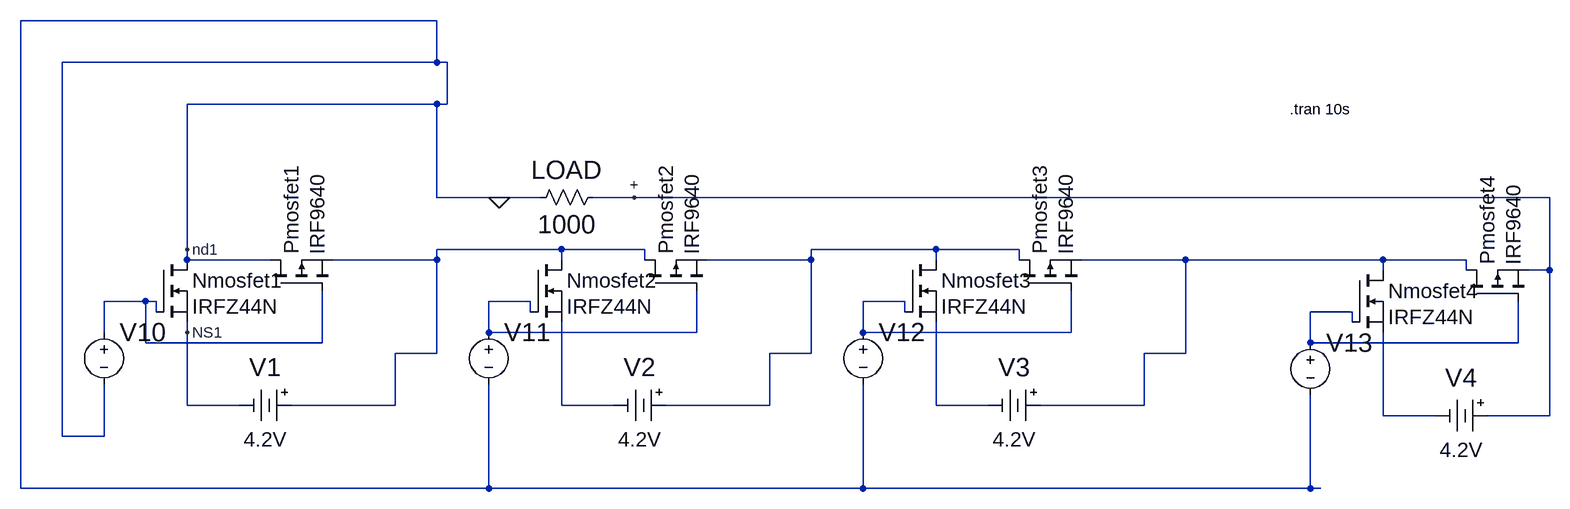
[diagram p0: schematic switching circuit.asc]
switching circuit.asc, the LTspice schematic file:
Version 4
SHEET 1 2468 1544
WIRE 512 32 -128 32
WIRE 512 96 512 32
WIRE 512 96 -64 96
WIRE 528 96 512 96
WIRE 512 160 128 160
WIRE 528 160 528 96
WIRE 528 160 512 160
WIRE 512 304 512 160
WIRE 608 304 512 304
WIRE 672 304 608 304
WIRE 816 304 752 304
WIRE 2224 304 816 304
WIRE 128 384 128 160
WIRE 704 384 512 384
WIRE 832 384 704 384
WIRE 1280 384 1088 384
WIRE 1408 384 1280 384
WIRE 128 400 128 384
WIRE 256 400 128 400
WIRE 512 400 512 384
WIRE 512 400 352 400
WIRE 704 400 704 384
WIRE 832 400 832 384
WIRE 1088 400 1088 384
WIRE 1088 400 928 400
WIRE 1280 400 1280 384
WIRE 1408 400 1408 384
WIRE 1664 400 1504 400
WIRE 1968 400 1664 400
WIRE 2096 400 1968 400
WIRE 1968 416 1968 400
WIRE 2096 416 2096 400
WIRE 2224 416 2224 304
WIRE 2224 416 2192 416
WIRE 64 464 0 464
WIRE 80 464 64 464
WIRE 656 464 592 464
WIRE 1232 464 1168 464
WIRE 80 480 80 464
WIRE 656 480 656 464
WIRE 1232 480 1232 464
WIRE 1920 480 1856 480
WIRE 1920 496 1920 480
WIRE 0 512 0 464
WIRE 128 512 128 496
WIRE 592 512 592 464
WIRE 912 512 912 448
WIRE 912 512 592 512
WIRE 1168 512 1168 464
WIRE 1488 512 1488 448
WIRE 1488 512 1168 512
WIRE 64 528 64 464
WIRE 336 528 336 448
WIRE 336 528 64 528
WIRE 1856 528 1856 480
WIRE 2176 528 2176 464
WIRE 2176 528 1856 528
WIRE 512 544 512 400
WIRE 512 544 448 544
WIRE 1088 544 1088 400
WIRE 1088 544 1024 544
WIRE 1664 544 1664 400
WIRE 1664 544 1600 544
WIRE 128 624 128 512
WIRE 208 624 128 624
WIRE 448 624 448 544
WIRE 448 624 288 624
WIRE 704 624 704 496
WIRE 784 624 704 624
WIRE 1024 624 1024 544
WIRE 1024 624 864 624
WIRE 1280 624 1280 496
WIRE 1360 624 1280 624
WIRE 1600 624 1600 544
WIRE 1600 624 1440 624
WIRE 1968 640 1968 512
WIRE 2048 640 1968 640
WIRE 2224 640 2224 416
WIRE 2224 640 2128 640
WIRE -64 672 -64 96
WIRE 0 672 0 592
WIRE 0 672 -64 672
WIRE -128 752 -128 32
WIRE 592 752 592 592
WIRE 592 752 -128 752
WIRE 1168 752 1168 592
WIRE 1168 752 592 752
WIRE 1856 752 1856 608
WIRE 1856 752 1168 752
WIRE 1872 752 1856 752
FLAG 608 304 0
FLAG 128 512 NS1
FLAG 128 384 nd1
FLAG 816 304 +
SYMBOL nmos 80 400 R0
WINDOW 0 56 32 Left 3
WINDOW 3 56 72 Left 3
SYMATTR InstName Nmosfet1
SYMATTR Value IRFZ44N
SYMBOL Misc/battery 304 624 R90
WINDOW 0 -32 56 VBottom 4
WINDOW 3 32 56 VTop 3
SYMATTR InstName V1
SYMATTR Value 4.2V
SYMBOL pmos 256 448 R270
WINDOW 0 56 32 Left 3
WINDOW 3 56 72 Left 3
SYMATTR InstName Pmosfet1
SYMATTR Value IRF9640
SYMBOL nmos 656 400 R0
WINDOW 0 56 32 Left 3
WINDOW 3 56 72 Left 3
SYMATTR InstName Nmosfet2
SYMATTR Value IRFZ44N
SYMBOL Misc/battery 880 624 R90
WINDOW 0 -32 56 VBottom 4
WINDOW 3 32 56 VTop 3
SYMATTR InstName V2
SYMATTR Value 4.2V
SYMBOL pmos 832 448 R270
WINDOW 0 56 32 Left 3
WINDOW 3 56 72 Left 3
SYMATTR InstName Pmosfet2
SYMATTR Value IRF9640
SYMBOL nmos 1232 400 R0
WINDOW 0 56 32 Left 3
WINDOW 3 56 72 Left 3
SYMATTR InstName Nmosfet3
SYMATTR Value IRFZ44N
SYMBOL Misc/battery 1456 624 R90
WINDOW 0 -32 56 VBottom 4
WINDOW 3 32 56 VTop 3
SYMATTR InstName V3
SYMATTR Value 4.2V
SYMBOL pmos 1408 448 R270
WINDOW 0 56 32 Left 3
WINDOW 3 56 72 Left 3
SYMATTR InstName Pmosfet3
SYMATTR Value IRF9640
SYMBOL Res 768 288 R90
WINDOW 0 0 56 VBottom 4
WINDOW 3 32 56 VTop 4
SYMATTR InstName LOAD
SYMATTR Value 1000
SYMBOL nmos 1920 416 R0
WINDOW 0 56 32 Left 3
WINDOW 3 56 72 Left 3
SYMATTR InstName Nmosfet4
SYMATTR Value IRFZ44N
SYMBOL Misc/battery 2144 640 R90
WINDOW 0 -32 56 VBottom 4
WINDOW 3 32 56 VTop 3
SYMATTR InstName V4
SYMATTR Value 4.2V
SYMBOL pmos 2096 464 R270
WINDOW 0 56 32 Left 3
WINDOW 3 56 72 Left 3
SYMATTR InstName Pmosfet4
SYMATTR Value IRF9640
SYMBOL voltage 0 496 R0
WINDOW 0 24 16 Left 4
WINDOW 3 24 96 Left 3
SYMATTR InstName V10
SYMATTR Value ""
SYMBOL voltage 592 496 R0
WINDOW 0 24 16 Left 4
WINDOW 3 24 96 Left 3
SYMATTR InstName V11
SYMATTR Value ""
SYMBOL voltage 1168 496 R0
WINDOW 0 24 16 Left 4
WINDOW 3 24 96 Left 3
SYMATTR InstName V12
SYMATTR Value ""
SYMBOL voltage 1856 512 R0
WINDOW 0 24 16 Left 4
WINDOW 3 24 96 Left 3
SYMATTR InstName V13
SYMATTR Value ""
TEXT 1824 168 Left 2 !.tran 10s

The netlist it stands for:
* switching circuit.asc
M§Nmosfet1 0 N004 NS1 NS1 IRFZ44N
V1 N001 NS1 4.2V
M§Pmosfet1 0 N004 N001 N001 IRF9640
M§Nmosfet2 N001 N005 N008 N008 IRFZ44N
V2 N002 N008 4.2V
M§Pmosfet2 N001 N005 N002 N002 IRF9640
M§Nmosfet3 N002 N006 N009 N009 IRFZ44N
V3 N003 N009 4.2V
M§Pmosfet3 N002 N006 N003 N003 IRF9640
R§LOAD + 0 1000
M§Nmosfet4 N003 N007 N010 N010 IRFZ44N
V4 + N010 4.2V
M§Pmosfet4 N003 N007 + + IRF9640
V10 N004 0
V11 N005 0
V12 N006 0
V13 N007 0
.model NMOS NMOS
.model PMOS PMOS
.lib standard.mos
.tran 10s
.backanno
.end